# EAGLE design meroTV (EAGLE 6.6.0)
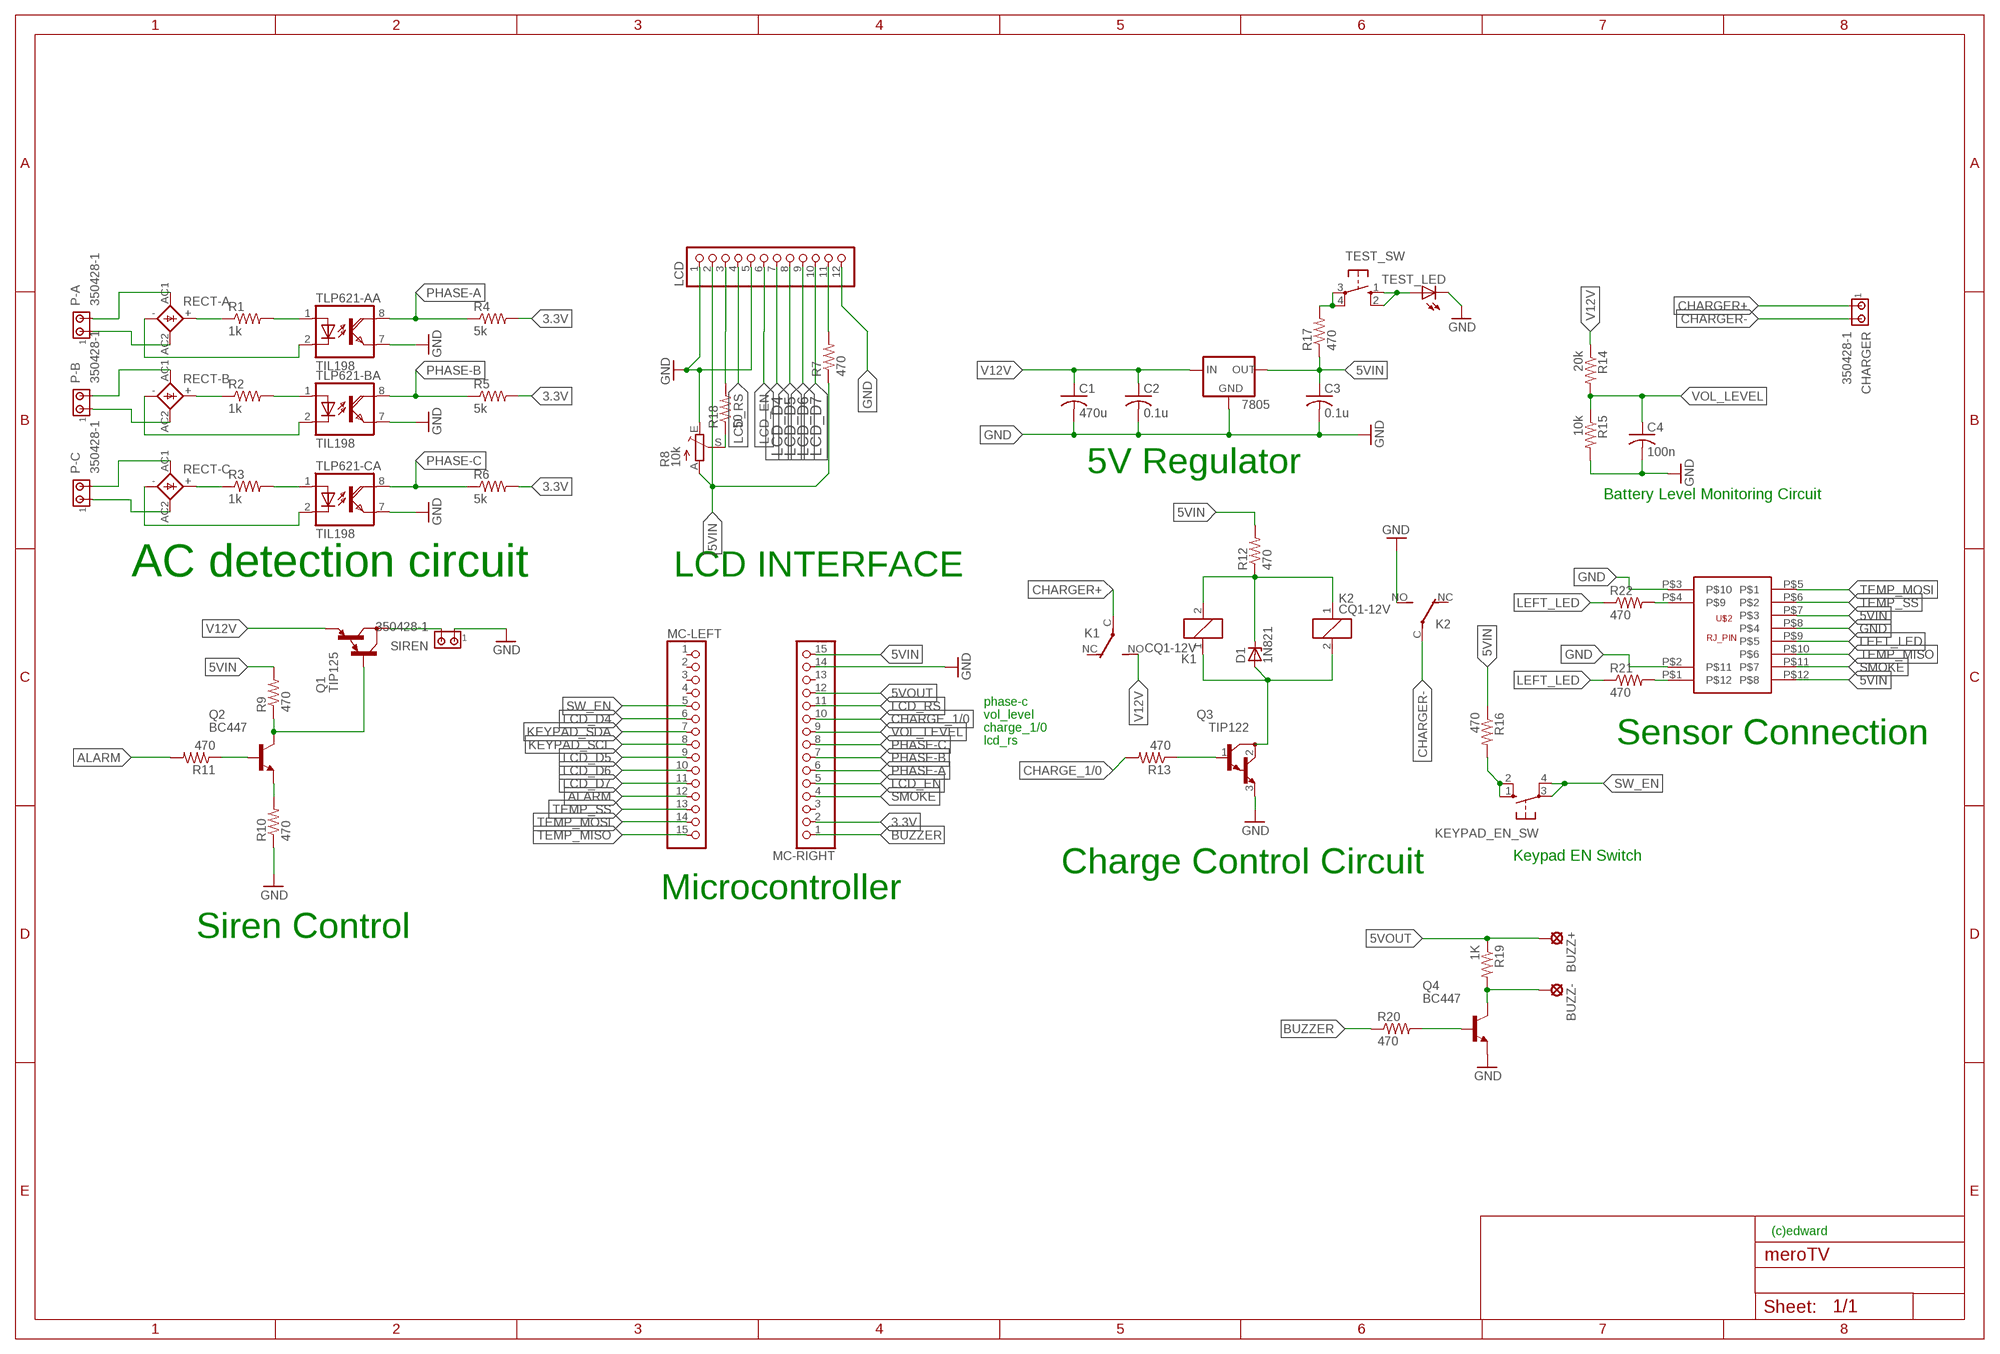
[diagram p0: schematic, sheet 1]

## Parts
7805  78MXXL  [78MXXL]
BUZZ+  SE11  [SE11]
BUZZ-  SE11  [SE11]
C1  470u  C-US025-040X050  [C025-040X050]
C2  0.1u  C-US025-030X050  [C025-030X050]
C3  0.1u  C-US025-030X050  [C025-030X050]
C4  100n  C-US025-030X050  [C025-030X050]
CHARGER  350428-1  [350428-1]
D1  1N821  [DO35Z10]
K1  CQ1-12V  [CQ1]
K2  CQ1-12V  [CQ1]
KEYPAD_EN_SW  10-XX  [B3F-10XX]
LCD  PINHD-1X12  [1X12]
MC-LEFT  PINHD-1X15  [1X15]
MC-RIGHT  PINHD-1X15  [1X15]
P-A  350428-1  [350428-1]
P-B  350428-1  [350428-1]
P-C  350428-1  [350428-1]
Q1  TIP125  [TO220]
Q2  BC447  [TO92-EBC]
Q3  TIP122  [TO220]
Q4  BC447  [TO92-EBC]
R1  1k  R-US_0204/5  [0204/5]
R2  1k  R-US_0204/5  [0204/5]
R3  1k  R-US_0204/5  [0204/5]
R4  5k  R-US_0204/5  [0204/5]
R5  5k  R-US_0204/5  [0204/5]
R6  5k  R-US_0204/5  [0204/5]
R7  470  R-US_0204/5  [0204/5]
R8  10k  TRIM_EU-B25V  [B25V]
R9  470  R-US_0204/5  [0204/5]
R10  470  R-US_0204/5  [0204/5]
R11  470  R-US_0204/5  [0204/5]
R12  470  R-US_0204/5  [0204/5]
R13  470  R-US_0204/5  [0204/5]
R14  20k  R-US_0204/5  [0204/5]
R15  10k  R-US_0204/5  [0204/5]
R16  470  R-US_0204/5  [0204/5]
R17  470  R-US_0204/5  [0204/5]
R18  50  R-US_0204/5  [0204/5]
R19  1K  R-US_0204/5  [0204/5]
R20  470  R-US_0204/5  [0204/5]
R21  470  R-US_0204/5  [0204/5]
R22  470  R-US_0204/5  [0204/5]
RECT-A  2KBB-R  [2KBB-R]
RECT-B  2KBB-R  [2KBB-R]
RECT-C  2KBB-R  [2KBB-R]
SIREN  350428-1  [350428-1]
TEST_LED  LED3MM  [LED3MM]
TEST_SW  10-XX  [B3F-10XX]
TLP621-A  TIL198  [DIL08]
TLP621-B  TIL198  [DIL08]
TLP621-C  TIL198  [DIL08]
U$2  RJ45_EDWRJ45-DIL  [RJ45-DIL]

## Nets
3.3V: MC-RIGHT.2 R4.2 R5.2 R6.2
5VIN: 7805.OUT C3.1 LCD.2 MC-RIGHT.15 R7.1 R8.A R9.2 R12.2 R16.1 R17.1 U$2.P$7 U$2.P$12
5VOUT: BUZZ+.MP MC-RIGHT.12 R19.1
ALARM: MC-LEFT.12 R11.2
BUZZER: MC-RIGHT.1 R20.1
CHARGE_1/0: MC-RIGHT.10 R13.2
CHARGER+: CHARGER.1 K1.C(2:P)
CHARGER-: CHARGER.2 K2.C(2:P)
GND: 7805.GND C1.2 C2.2 C3.2 C4.2 K2.NO(2:S) LCD.1 LCD.5 LCD.12 MC-RIGHT.14 Q3.3(E) Q4.E R8.E R10.1 R15.2 SIREN.1 TEST_LED.K(C) TLP621-A.7(A:EMI) TLP621-B.7(A:EMI) TLP621-C.7(A:EMI) U$2.P$2 U$2.P$3 U$2.P$8
KEYPAD_SCL: MC-LEFT.8
KEYPAD_SDA: MC-LEFT.7
LCD_D4: LCD.7 MC-LEFT.6
LCD_D5: LCD.8 MC-LEFT.9
LCD_D6: LCD.9 MC-LEFT.10
LCD_D7: LCD.10 MC-LEFT.11
LCD_EN: LCD.6 MC-RIGHT.5
LCD_RS: LCD.4 MC-RIGHT.11
LEFT_LED: R21.1 R22.1 U$2.P$9
N$1: Q1.2(C) SIREN.2
N$2: P-A.1 RECT-A.AC2
N$3: P-B.2 RECT-B.AC1
N$4: P-B.1 RECT-B.AC2
N$5: P-C.2 RECT-C.AC1
N$6: P-C.1 RECT-C.AC2
N$7: R1.1 RECT-A.+
N$8: R2.1 RECT-B.+
N$9: R1.2 TLP621-A.1(A:A)
N$10: R2.2 TLP621-B.1(A:A)
N$11: R3.2 TLP621-C.1(A:A)
N$12: R3.1 RECT-C.+
N$13: RECT-A.- TLP621-A.2(A:C)
N$14: RECT-B.- TLP621-B.2(A:C)
N$15: RECT-C.- TLP621-C.2(A:C)
N$16: D1.C K1.2 K2.1 R12.1
N$17: KEYPAD_EN_SW.1(S) KEYPAD_EN_SW.2(S1) R16.2
N$18: D1.A K1.1 K2.2 Q3.2(C)
N$19: Q1.1(B) Q2.C R9.1
N$20: Q2.E R10.2
N$21: Q2.B R11.1
N$22: Q3.1(B) R13.1
N$23: R17.2 TEST_SW.3(P) TEST_SW.4(P1)
N$24: TEST_LED.A TEST_SW.1(S) TEST_SW.2(S1)
N$25: LCD.11 R7.2
N$26: R8.S R18.1
N$27: LCD.3 R18.2
N$28: BUZZ-.MP Q4.C R19.2
N$29: R22.2 U$2.P$4
N$30: R21.2 U$2.P$1
N$31: Q4.B R20.2
P-A: P-A.2 RECT-A.AC1
PHASE-A: MC-RIGHT.6 R4.1 TLP621-A.8(A:COL)
PHASE-B: MC-RIGHT.7 R5.1 TLP621-B.8(A:COL)
PHASE-C: MC-RIGHT.8 R6.1 TLP621-C.8(A:COL)
SMOKE: MC-RIGHT.4 U$2.P$11
SW_EN: KEYPAD_EN_SW.3(P) KEYPAD_EN_SW.4(P1) MC-LEFT.5
TEMP_MISO: MC-LEFT.15 U$2.P$10
TEMP_MOSI: MC-LEFT.14 U$2.P$5
TEMP_SS: MC-LEFT.13 U$2.P$6
V12V: 7805.IN C1.1 C2.1 K1.NO(2:S) Q1.3(E) R14.1
VOL_LEVEL: C4.1 MC-RIGHT.9 R14.2 R15.1
Unconnected: K1.NC(2:O) K2.NC(2:O) MC-LEFT.1 MC-LEFT.2 MC-LEFT.3 MC-LEFT.4 MC-RIGHT.3 MC-RIGHT.13 TLP621-A.3(B:A) TLP621-A.4(B:C) TLP621-A.5(B:EMI) TLP621-A.6(B:COL) TLP621-B.3(B:A) TLP621-B.4(B:C) TLP621-B.5(B:EMI) TLP621-B.6(B:COL) TLP621-C.3(B:A) TLP621-C.4(B:C) TLP621-C.5(B:EMI) TLP621-C.6(B:COL)

## Notes on the sheet
- 5V Regulator
- Battery Level Monitoring Circuit
- AC detection circuit | LCD INTERFACE
- phase-c
- vol_level
- charge_1/0
- lcd_rs | Sensor Connection
- Keypad EN Switch
- Charge Control Circuit
- Microcontroller
- Siren Control
- (c)edward

## Library data of the parts
7805 = v-reg:78MXXL: VOLTAGE REGULATOR
BUZZ+ BUZZ- = solpad:SE11: SOLDER PAD RTM, drill 1,1mm, distributor Buerklin, 07F810
C1-C4 = rcl:C-US: CAPACITOR, American symbol
CHARGER P-A P-B P-C SIREN = con-amp:350428-1: Universal MATE-N-LOK .250" Centerline, 600 V, 19 - 36 A max Source: http://catalog.tycoelectronics.com/ .. ENG_CD_350428_Y.pdf
D1 = diode:1N821: Reference DIODE temperature compensated, 6,2 V
K1 K2 = relay:CQ1-12V: AUTOMOTIVE QUIET RELAY NAiS Source: http://www.mew-europe.com/.. en_ds_61208_0000.pdf; OC_FARNELL: unknown; OC_NEWARK: unknown
KEYPAD_EN_SW TEST_SW = switch-omron:10-XX: OMRON SWITCH; MPN: B3F-1000; OC_FARNELL: 176432; OC_NEWARK: 36M3542
LCD = pinhead:PINHD-1X12: PIN HEADER
MC-LEFT MC-RIGHT = pinhead:PINHD-1X15: PIN HEADER
Q1 = transistor-pnp:TIP125: PNP Transistor
Q2 Q4 = transistor-npn:BC447*: NPN Transistor
Q3 = transistor-npn:TIP122*: NPN Darlington Transistor
R1-R7 R9-R22 = rcl:R-US_: RESISTOR, American symbol
R8 = pot:TRIM_EU-: POTENTIOMETER
RECT-A RECT-B RECT-C = rectifier:2KBB-R: RECTIFIER grid 3 x 5 mm
TEST_LED = led:LED: LED OSRAM: - CHIPLED LG R971, LG N971, LY N971, LG Q971, LY Q971, LO R971, LY R971 LH N974, LH R974 LS Q976, LO Q976, LY Q976 LO Q996 - Hyper CHIPLED LW Q18S LB Q993, LB Q99A, LB R99A - SideLED LS A670, LO A670, LY A670, LG A670, LP A670 LB A673, LV A673, LT A673, LW A673 LH A674 LY A675 LS A676, LA A676, LO A676, LY A676, LW A676 LS A679, LY A679, LG A679 - Hyper Micro SIDELED® LS Y876, LA Y876, LO Y876, LY Y876 LT Y87S - SmartLED LW L88C, LW L88S LB L89C, LB L89S, LG L890 LS L89K, LO L89K, LY L89K LS L896, LA L896, LO L896, LY L896 - TOPLED LS T670, LO T670, LY T670, LG T670, LP T670 LSG T670, LSP T670, LSY T670, LOP T670, LYG T670 LG T671, LOG T671, LSG T671 LB T673, LV T673, LT T673, LW T673 LH T674 LS T676, LA T676, LO T676, LY T676, LB T676, LH T676, LSB T676, LW T676 LB T67C, LV T67C, LT T67C, LS T67K, LO T67K, LY T67K, LW E67C LS E67B, LA E67B, LO E67B, LY E67B, LB E67C, LV E67C, LT E67C LW T67C LS T679, LY T679, LG T679 LS T770, LO T770, LY T770, LG T770, LP T770 LB T773, LV T773, LT T773, LW T773 LH T774 LS E675, LA E675, LY E675, LS T675 LS T776, LA T776, LO T776, LY T776, LB T776 LHGB T686 LT T68C, LB T68C - Hyper Mini TOPLED® LB M676 - Mini TOPLED Santana® LG M470 LS M47K, LO M47K, LY M47K Source: http://www.osram.convergy.de LUXEON: - LUMILED® LXK2-PW12-R00, LXK2-PW12-S00, LXK2-PW14-U00, LXK2-PW14-V00 LXK2-PM12-R00, LXK2-PM12-S00, LXK2-PM14-U00 LXK2-PE12-Q00, LXK2-PE12-R00, LXK2-PE12-S00, LXK2-PE14-T00, LXK2-PE14-U00 LXK2-PB12-K00, LXK2-PB12-L00, LXK2-PB12-M00, LXK2-PB14-N00, LXK2-PB14-P00, LXK2-PB14-Q00 LXK2-PR12-L00, LXK2-PR12-M00, LXK2-PR14-Q00, LXK2-PR14-R00 LXK2-PD12-Q00, LXK2-PD12-R00, LXK2-PD12-S00 LXK2-PH12-R00, LXK2-PH12-S00 LXK2-PL12-P00, LXK2-PL12-Q00, LXK2-PL12-R00 Source: www.luxeon.com KINGBRIGHT: KA-3528ASYC Source: www.kingbright.com
TLP621-A TLP621-B TLP621-C = optocoupler:TIL198: TEXAS INSTRUMENTS OPTO COUPLER; OC_FARNELL: unknown; OC_NEWARK: unknown
U$2 = RJ45:RJ45_EDW

## Board
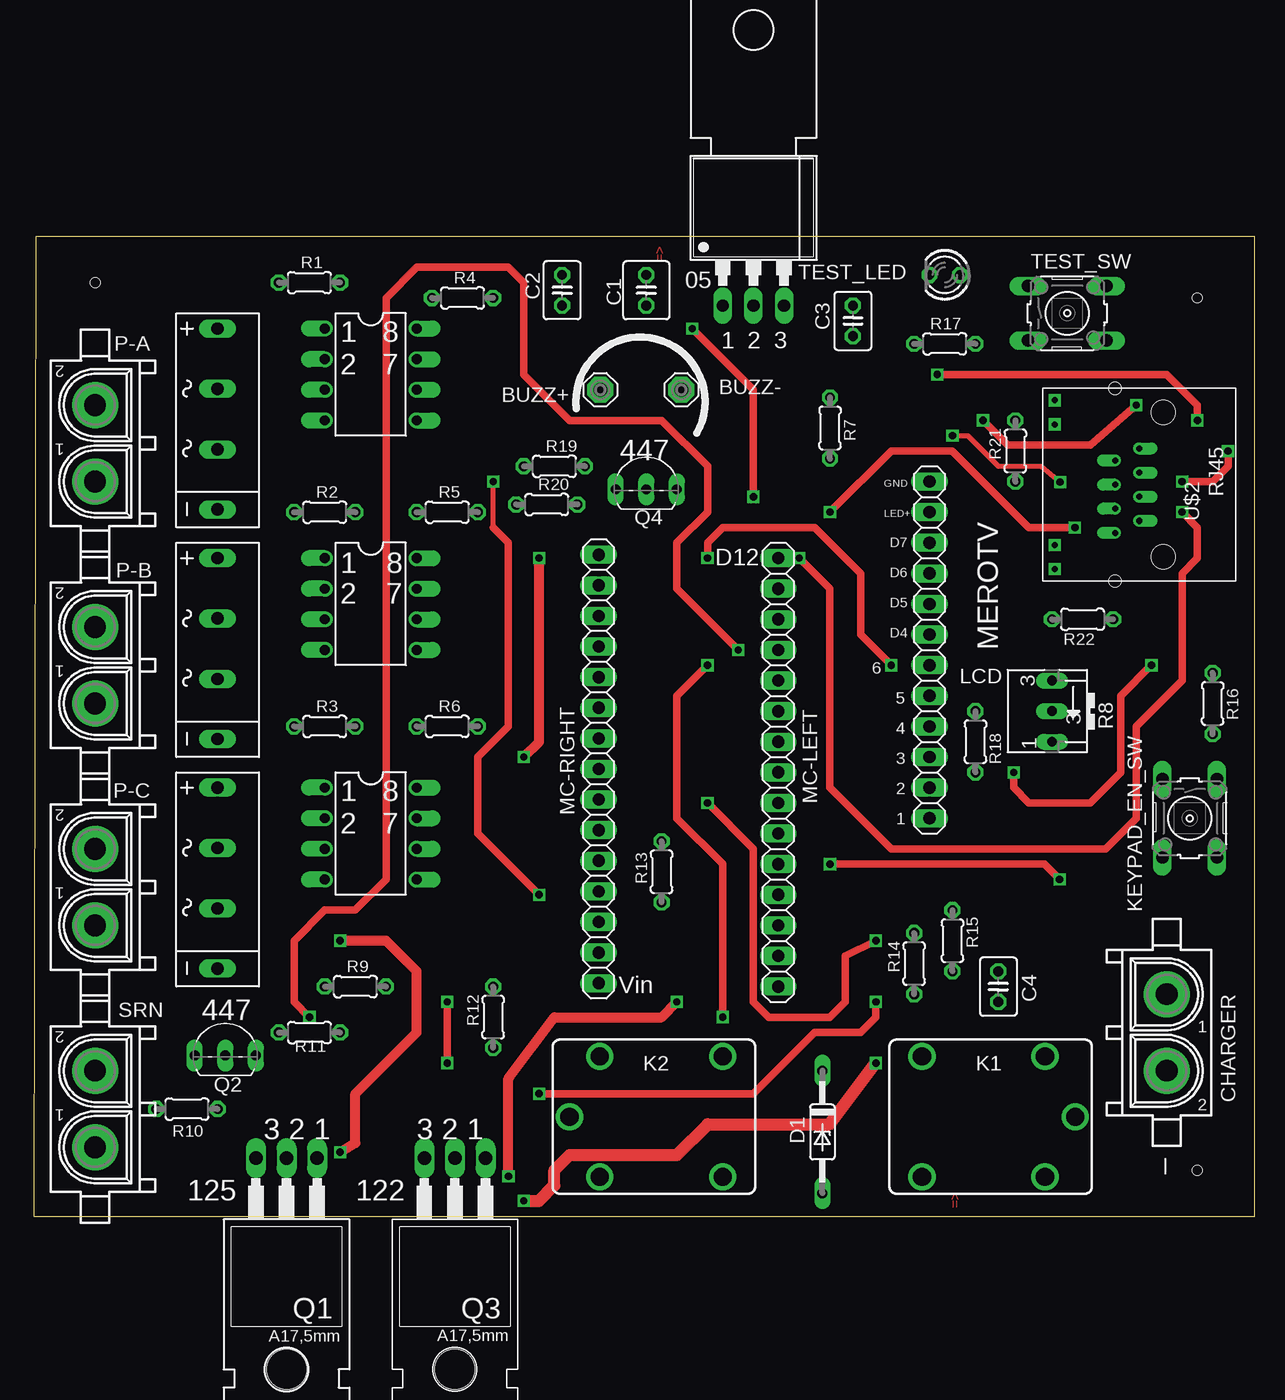
[diagram p1: board, top side]
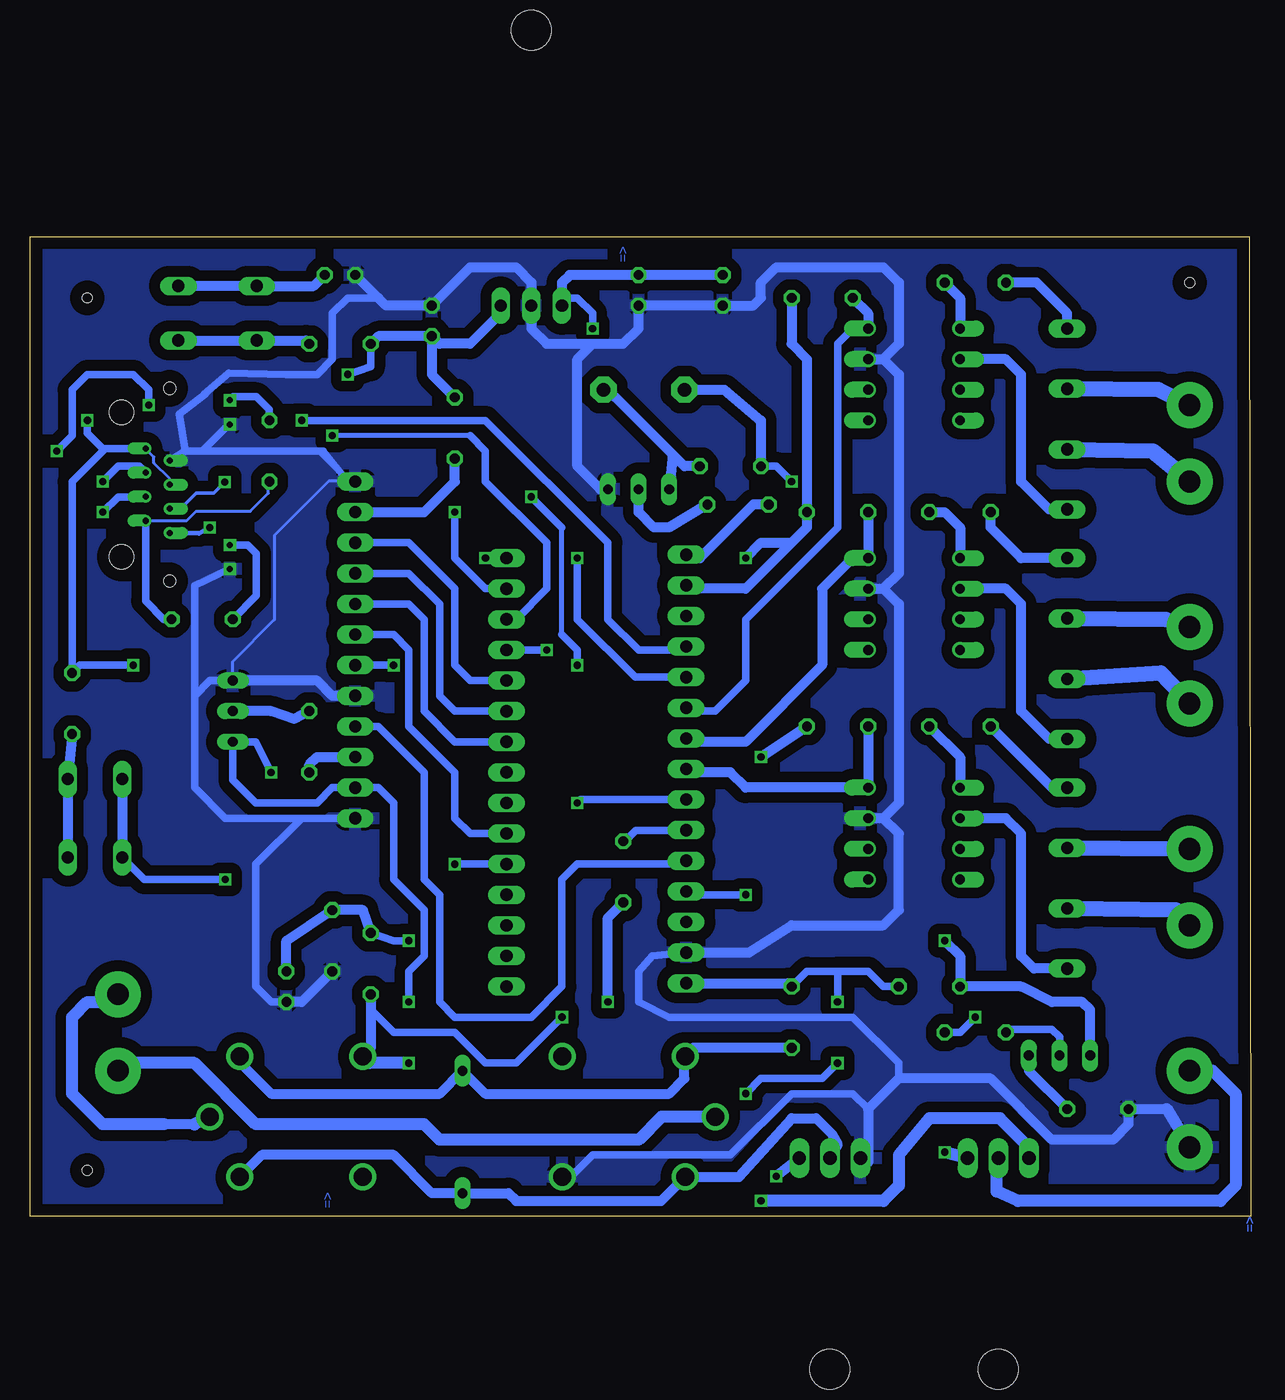
[diagram p2: board, bottom side, seen from below]

Size 101.27 x 81.27 mm. Coordinates in mm from the lower left corner, seen from the top.
Outline: 0,0 101.27,0 101.27,81.27 0.14,81.27 0,0
Copper layers (1*16): Top 0.035mm / dielectric 1.5mm / Bottom 0.035mm
Design rules "default *": minimum track width 10mil, minimum drill 24mil, track to track 35mil, track to pad 25mil, pad to pad 8mil, via to via 8mil, smd to smd 8mil, copper to edge 40mil, drill to drill 8mil, minimum pad ring 10mil, minimum via ring 8mil, stop-mask expansion 4mil, vias tented up to drill 0mil, thermal gap 10mil
Holes 0.8 mm at 96.52,3.81 96.52,76.2 5.08,77.47

### Footprints (pad centres in the part's own frame; a part is rotated, then mirrored left to right if it is on the bottom)
78MXXL = drill 1.016 long: GND 0,-5.08; IN -2.54,-5.08; OUT 2.54,-5.08 | hole 3.302: 0,17.78
SE11 = drill 1.118 pad 2.159 octagon: MP 0,0
C025-040X050 = drill 0.813 octagon: 1 -1.27,0; 2 1.27,0
C025-030X050 = drill 0.813 octagon: 1 -1.27,0; 2 1.27,0
350428-1 = drill 1.8 pad 3.81: 1 -3.175,0; 2 3.175,0
DO35Z10 = drill 0.813 long: A 5.08,0; C -5.08,0
CQ1 = drill 1.5: 1 4.5,-5; 2 4.5,5; C 7,0; NC -5.7,-5; NO -5.7,5
B3F-10XX = drill 1.016 long: 1 -3.251,2.261; 2 3.251,2.261; 3 -3.251,-2.261; 4 3.251,-2.261
1X12 = drill 1.016 long: 1 -13.97,0; 2 -11.43,0; 3 -8.89,0; 4 -6.35,0; 5 -3.81,0; 6 -1.27,0; 7 1.27,0; 8 3.81,0; 9 6.35,0; 10 8.89,0; 11 11.43,0; 12 13.97,0
1X15 = drill 1.016 long: 1 -17.78,0; 2 -15.24,0; 3 -12.7,0; 4 -10.16,0; 5 -7.62,0; 6 -5.08,0; 7 -2.54,0; 8 0,0; 9 2.54,0; 10 5.08,0; 11 7.62,0; 12 10.16,0; 13 12.7,0; 14 15.24,0; 15 17.78,0
TO220 = drill 1.118 long: 1 -2.54,-6.35; 2 0,-6.35; 3 2.54,-6.35 | hole 3.302: 0,11.176
TO92-EBC = drill 0.813 long: B 0,-1.27; C -2.54,-1.27; E 2.54,-1.27
0204/5 = drill 0.813 octagon: 1 -2.54,0; 2 2.54,0
B25V = drill 0.813 long: A 2.54,0.635; E -2.54,0.635; S 0,0.635
2KBB-R = drill 1.016 long: + -7.62,0; - 7.391,0; AC1 -2.616,0; AC2 2.413,0
LED3MM = drill 0.813 octagon: A -1.27,0; K 1.27,0
DIL08 = drill 0.813 offset: 1 -3.81,-3.81; 2 -1.27,-3.81; 3 1.27,-3.81; 4 3.81,-3.81; 5 3.81,3.81; 6 1.27,3.81; 7 -1.27,3.81; 8 -3.81,3.81
RJ45-DIL = drill 0.5 square: P$1 15,15; P$2 13,15; P$3 1,15; P$4 3,15 | drill 0.5 pad 1.016 offset: P$5 4,10; P$6 6,10; P$7 8,10; P$8 10,10; P$9 5,8; P$10 7,8; P$11 9,8; P$12 11,8 | hole 1: 16,10; 0,10 | hole 2: 14,6; 2,6

### Placement (x,y rotation side)
7805  59.69,80.64 0 top
BUZZ+  46.99,68.58 0 top
BUZZ-  53.7,68.58 0 top
C1  50.8,76.83 270 top
C2  43.81,76.83 270 top
C3  67.94,74.3 90 top
C4  80.01,19.05 270 top
CHARGER  93.98,15.24 270 top
D1  65.41,6.99 270 top
K1  79.38,8.26 0 top
K2  51.44,8.26 180 top
KEYPAD_EN_SW  95.89,33.02 270 top
LCD  74.3,46.99 90 top
MC-LEFT  61.75,36.83 90 top
MC-RIGHT  46.85,37.11 270 top
P-A  5.08,64.14 90 top
P-B  5.08,45.72 90 top
P-C  5.08,27.3 90 top
Q1  20.95,-1.54 180 top
Q2  15.88,14.61 0 top
Q3  34.92,-1.54 180 top
Q4  50.8,61.59 0 top
R1  22.86,77.47 0 top
R2  24.13,58.42 0 top
R3  24.13,40.64 0 top
R4  35.56,76.2 0 top
R5  34.29,58.42 0 top
R6  34.29,40.64 0 top
R7  66.04,65.41 270 top
R8  83.82,41.91 270 top
R9  26.67,19.05 0 top
R10  12.7,8.89 0 top
R11  22.86,15.24 0 top
R12  38.1,16.51 90 top
R13  52.07,28.57 90 top
R14  73.03,20.95 90 top
R15  76.2,22.86 270 top
R16  97.79,42.55 270 top
R17  75.56,72.39 0 top
R18  78.11,39.37 270 top
R19  43.18,62.23 0 top
R20  42.55,59.05 0 top
R21  81.42,63.5 90 top
R22  87,49.53 180 top
RECT-A  15.24,66.04 270 top
RECT-B  15.24,46.99 270 top
RECT-C  15.24,27.94 270 top
SIREN  5.08,8.89 90 top
TEST_LED  75.56,78.11 180 top
TEST_SW  85.72,74.93 0 top
TLP621-A  27.94,69.85 270 top
TLP621-B  27.94,50.8 270 top
TLP621-C  27.94,31.75 270 top
U$2  99.69,52.7 90 top

### Tracks (layer width: path | path; a pad name or v marks a point on that pad's centre or on a via)
3.3V  (via drill 0.6)
  Top 0.813: v40.64,38.1 41.91,39.37 v41.91,54.61
  Bottom 0.813: 38.1,55.88 36.83,57.15 R5.2 36.83,71.12 38.1,72.39 R4.2 | 38.1,55.88 41.91,52.07 46.57,52.07 MC-RIGHT.2 | R6.2 v40.64,38.1 | v41.91,54.61 40.64,55.88 38.1,55.88
5VIN  (via drill 0.6)
  Top 0.61: v81.28,36.83 81.28,35.56 82.55,34.29 87.63,34.29 90.17,36.83 90.17,43.18 v92.71,45.72 | v74.93,69.85 93.98,69.85 96.52,67.31 v96.52,66.04 | v69.85,17.78 69.85,16.51 68.58,15.24 64.77,15.24 59.69,10.16 v41.91,10.16 | v34.29,12.7 v34.29,17.78
  Bottom 0.254: U$2.P$7 89.69,61.2 91,62.5 91,63.01 U$2.P$12
  Bottom 0.61: U$2.P$12 95.05,63.7 | 95.05,63.7 95.25,63.7 96.52,64.97 v96.52,66.04 | 95.05,63.7 97.79,60.96 R16.1 97.16,45.72 v92.71,45.72 | v81.28,36.83 82.55,39.37 R8.A 84.45,36.2 82.55,34.29 77.47,34.29 76.2,35.56 LCD.2 72.39,35.56 71.12,34.29 71.12,27.94 68.58,25.4 68.58,21.59 69.85,20.32 v69.85,17.78 | R17.1 73.03,70.48 v74.93,69.85 | v41.91,10.16 40.64,11.43 35.56,11.43 v34.29,12.7 | v34.29,17.78 34.29,20.32 | R9.2 30.48,19.05 31.75,20.32 34.29,20.32 | R12.2 36.83,20.32 34.29,20.32
  Bottom 0.813: 7805.OUT 62.23,74.93 64.77,72.39 67.31,72.39 C3.1 | C3.1 72.39,73.03 R17.1 | C3.1 67.94,69.85 R7.1 | MC-RIGHT.15 38.38,19.33 R12.2
5VOUT  (via drill 0.6)
  Top 0.406: 38.1,57.15 v38.1,60.96
  Top 0.61: v41.91,26.67 36.83,31.75 36.83,38.1 39.37,40.64 39.37,55.88 38.1,57.15
  Bottom 0.61: R19.1 39.37,62.23 v38.1,60.96 | v41.91,26.67 46.57,26.67 MC-RIGHT.12
  Bottom 0.813: BUZZ+.MP 43.68,68.58 40.64,66.04 R19.1
ALARM  (via drill 0.6)
  Top 0.61: v22.86,16.51 21.59,17.78 21.59,22.86 24.13,25.4 26.67,25.4 29.21,27.94 29.21,76.2 31.75,78.74 39.37,78.74 40.64,77.47 40.64,69.85 44.45,66.04 52.07,66.04 55.88,62.23 55.88,58.42 53.34,55.88 53.34,52.07 v58.42,46.99
  Bottom 0.61: R11.2 24.13,15.24 v22.86,16.51 | v58.42,46.99 MC-LEFT.12
BUZZER
  Bottom 0.813: R20.1 41.27,59.05 45.72,54.61 46.57,54.61 MC-RIGHT.1
CHARGE_1/0
  Bottom 0.61: R13.2 51.94,31.11 51.03,32.02 48.34,32.02 MC-RIGHT.10
CHARGER+
  Bottom 0.813: 87.64,7.61 90.17,7.62
  Bottom 1.016: K1.C 87.64,7.61 | 90.17,7.62 95.25,7.62 97.79,10.16 97.79,16.51 96.52,17.78 94.61,17.78 CHARGER.1
CHARGER-
  Bottom 1.016: K2.C 48.9,8.26 50.8,6.35 67.31,6.35 68.58,7.62 82.55,7.62 87.63,12.7 93.34,12.7 CHARGER.2
GND
  Bottom 0.254: 87,63.5 77.5,63.5 75,61 76.5,61 81,56.5 81,49.5 84.5,46 84.5,44.49 R8.E
  Bottom 0.61: 29.21,11.43 29.21,12.7 33.02,16.51 48.26,16.51 50.8,17.78 50.8,20.32 49.67,21.59 MC-RIGHT.14 | K2.NO 56.44,3.25 54.61,5.08 43.18,5.08 38.1,10.16 33.02,10.16 31.75,8.89 | C4.2 81.28,17.78 82.55,19.05 82.55,29.21 78.74,33.02 LCD.1 85.09,33.02 87.63,35.56 87.63,43.18 | 87.63,43.18 86.36,44.45 R8.E | 84.77,53.7 87.63,52.34 87.63,43.18 | 86.73,68.2 88.9,66.54 88.4,63.5 | 72.39,76.2 74.93,76.2 76.2,74.93 76.2,71.12 77.47,69.85 80.01,69.85 84.81,69.95 86.81,68.2 | LCD.12 74.93,60.96 76.97,63.5 87,63.5 | 87,63.5 88.4,63.5 | 88.4,63.5 U$2.P$8 | U$2.P$2 84.8,65.7 87,63.5
  Bottom 0.813: TLP621-A.7 30.48,71.12 | 30.48,71.12 29.21,69.85 29.21,53.34 30.48,52.07 | TLP621-B.7 30.48,52.07 | 30.48,52.07 29.21,50.8 29.21,34.29 30.48,33.02 | 30.48,33.02 TLP621-C.7 | TEST_LED.K 72.39,76.2 71.75,75.56 C3.2 64.77,78.74 60.96,78.74 59.69,77.47 7805.GND 59.69,73.66 58.42,72.39 54.61,72.39 | R15.2 78.74,17.78 C4.2 | LCD.5 76.2,43.18 77.47,44.45 R8.E | 6.99,8.89 R10.1 10.16,7.62 11.43,6.35 16.51,6.35 21.59,11.43 29.21,11.43 31.75,8.89 31.75,4.45 Q3.3 | 30.48,71.12 29.21,72.39 29.21,77.47 30.48,78.74 39.37,78.74 40.64,77.47 40.64,76.2 41.27,75.56 C2.2 C1.2 50.8,73.66 52.07,72.39 54.61,72.39 | Q4.E 53.98,60.33 55.88,62.23 55.88,71.12 54.61,72.39 | MC-RIGHT.14 41.63,21.87 38.1,24.13 30.48,24.13 29.21,25.4 29.21,31.75 30.48,33.02
  Bottom 1.016: 6.99,8.89 SIREN.1
  pour Bottom: 0,80.78 1.27,0 101.6,-1.27 101.5,62.5 102,81.78
LCD_D4
  Bottom 0.61: LCD.7 71.12,48.26 69.85,46.99 69.85,40.64 66.04,36.83 66.04,33.02 64.77,31.75 MC-LEFT.6
LCD_D5
  Bottom 0.61: MC-LEFT.9 66.04,39.37 68.58,41.91 68.58,49.53 69.85,50.8 LCD.8
LCD_D6
  Bottom 0.61: MC-LEFT.10 66.04,41.91 67.31,43.18 67.31,50.8 69.85,53.34 LCD.9
LCD_D7
  Bottom 0.61: MC-LEFT.11 64.77,44.45 66.04,45.72 66.04,52.07 69.85,55.88 LCD.10
LCD_EN  (via drill 0.6)
  Top 0.61: v71.12,45.72 68.58,48.26 68.58,53.34 64.77,57.15 57.15,57.15 55.88,55.88 v55.88,54.61
  Bottom 0.61: MC-RIGHT.5 51.08,44.73 55.88,49.53 v55.88,54.61 | v71.12,45.72 LCD.6
LCD_RS
  Bottom 0.61: MC-RIGHT.11 47.13,29.21 55.88,29.21 57.15,27.94 57.15,19.05 59.69,16.51 66.04,16.51 67.31,17.78 67.31,26.67 68.58,27.94 68.58,36.83 72.39,40.64 LCD.4
LEFT_LED
  Bottom 0.254: U$2.P$9 88.3,57.7 87.5,58.5 83,58.5 81.5,60 81.5,60.88 R21.1
  Bottom 0.61: 89.69,49.69 R22.1 90.17,49.53 91.69,51.05 U$2.P$9
N$1
  Bottom 1.016: SIREN.2 3.17,12.06 1.27,10.16 1.27,2.54 2.54,1.27 19.32,1.27 21.09,2.04 21.09,3.17 Q1.2
N$2
  Bottom 1.27: P-A.1 8.13,63.5 RECT-A.AC2
N$3
  Bottom 1.27: P-B.2 7.06,49.53 RECT-B.AC1
N$4
  Bottom 1.27: P-B.1 7.49,45.09 RECT-B.AC2
N$5
  Bottom 1.27: P-C.2 6.43,30.48 RECT-C.AC1
N$6
  Bottom 1.27: P-C.1 6.22,25.4 RECT-C.AC2
N$7
  Bottom 0.813: RECT-A.+ 15.24,74.93 17.78,77.47 R1.1
N$8
  Bottom 0.813: RECT-B.+ 19.05,54.61 21.59,57.15 R2.1
N$9
  Bottom 0.813: R1.2 24.13,76.2 TLP621-A.1
N$10
  Bottom 0.813: R2.2 25.4,58.42 24.13,57.15 TLP621-B.1
N$11
  Bottom 0.813: R3.2 24.13,38.1 TLP621-C.1
N$12
  Bottom 0.813: RECT-C.+ 16.51,35.56 R3.1
N$13
  Bottom 0.813: RECT-A.- 16.74,58.65 19.05,60.96 19.05,69.85 20.32,71.12 TLP621-A.2
N$14
  Bottom 0.813: RECT-B.- 16.74,39.6 19.05,41.91 19.05,50.8 20.32,52.07 TLP621-B.2
N$15
  Bottom 0.813: RECT-C.- 18.01,20.55 19.05,21.59 19.05,31.75 20.32,33.02 TLP621-C.2
N$16
  Bottom 0.813: R12.1 46.22,13.97 K2.1 46.99,13.2 46.99,11.43 48.26,10.16 63.5,10.16 D1.C 67.31,10.16 81.28,10.16 83.88,12.76 K1.2
N$17
  Bottom 0.813: R16.2 KEYPAD_EN_SW.1 KEYPAD_EN_SW.2
N$18
  Bottom 0.813: K1.1 82.05,5.08 71.12,5.08 67.94,1.91 D1.A 61.59,1.91 60.96,1.27 48.92,1.27 K2.2 42.47,3.25 38.1,8.12 36.06,8.12 34.79,6.85 34.29,5.95 Q3.2
N$19  (via drill 0.6)
  Top 0.813: v25.4,5.31 26.67,6.08 26.67,10.16 31.75,15.24 31.75,20.32 29.21,22.86 v25.4,22.86
  Bottom 0.813: Q2.C 13.34,17.14 13.97,17.78 16.51,17.78 19.05,19.05 R9.1 24.13,21.59 v25.4,22.86
  Bottom 1.016: Q1.1 v25.4,5.31
N$20
  Bottom 0.813: Q2.E 18.41,12.06 R10.2
N$21
  Bottom 0.61: Q2.B 15.88,14.88 16.5,15.5 20.06,15.5 R11.1
N$22  (via drill 0.6)
  Top 0.813: v39.37,3.31 39.37,11.43 43.18,16.51 52.07,16.51 v53.34,17.78
  Bottom 0.813: Q3.1 v39.37,3.31 | v53.34,17.78 53.34,24.77 R13.1
N$23
  Bottom 0.813: TEST_SW.4 TEST_SW.3 78.38,72.67 R17.2
N$24
  Bottom 0.813: TEST_LED.A 77.75,77.19 TEST_SW.1 TEST_SW.2
N$25
  Bottom 0.813: LCD.11 68.58,58.42 66.04,60.96 R7.2
N$26
  Bottom 0.813: R18.1 79.38,41.27 81.28,41.91 R8.S
N$27
  Bottom 0.813: R18.2 78.11,37.47 77.47,38.1 LCD.3
N$28
  Bottom 0.813: 47.94,63.18 Q4.C | BUZZ-.MP 52.7,67.94 47.94,63.18 | R19.2 46.99,62.23 47.94,63.18
N$29
  Bottom 0.61: U$2.P$4 83.2,55.7 82.5,55 82.5,51.48 R22.2
N$30
  Bottom 0.61: R21.2 81.42,66.92 82.5,68 84.4,68 U$2.P$1
N$31
  Bottom 0.813: R20.2 48.26,57.15 49.53,57.15 50.8,58.42 Q4.B
P-A
  Bottom 1.27: P-A.2 7.7,68.58 RECT-A.AC1
PHASE-A
  Bottom 0.406: TLP621-A.8 33.02,73.66 | 46.57,41.91 MC-RIGHT.6
  Bottom 0.61: 33.02,73.66 34.29,72.39 34.29,57.15 41.91,49.53 41.91,44.45 44.45,41.91 46.57,41.91
  Bottom 0.813: R4.1 31.75,74.93 TLP621-A.8
PHASE-B
  Bottom 0.813: R5.1 TLP621-B.8 33.02,54.61 35.56,52.07 35.56,45.72 41.91,39.37 46.57,39.37 MC-RIGHT.7
PHASE-C
  Bottom 0.813: R6.1 TLP621-C.8 41.91,35.56 43.18,36.83 46.57,36.83 MC-RIGHT.8
SMOKE  (via drill 0.6)
  Top 0.61: v78.74,66.04 80.78,64 87.63,64 v91.44,67.31 | v99.06,63.5 99.06,62.23 97.79,60.96 v95.25,60.96
  Bottom 0.61: MC-RIGHT.4 47.13,46.99 50.8,46.99 53.34,49.53 53.34,55.88 63.5,66.04 v78.74,66.04 | v91.44,67.31 91.44,68.58 92.71,69.85 96.52,69.85 97.79,68.58 97.79,64.77 v99.06,63.5 | v95.25,60.96 93.98,62.23 92.22,62.23 U$2.P$11
SW_EN  (via drill 0.6)
  Top 0.61: v85.09,27.94 83.82,29.21 v66.04,29.21
  Bottom 0.61: KEYPAD_EN_SW.4 91.8,27.94 v85.09,27.94 | v66.04,29.21 MC-LEFT.5
  Bottom 0.813: KEYPAD_EN_SW.3 KEYPAD_EN_SW.4
TEMP_MISO  (via drill 0.6)
  Top 0.61: v63.5,54.61 66.04,52.07 66.04,35.56 71.12,30.48 88.9,30.48 91.44,33.02 91.44,40.64 95.25,44.45 95.25,53.34 96.52,54.61 96.52,57.15 v95.25,58.42
  Bottom 0.61: MC-LEFT.15 v63.5,54.61 | U$2.P$10 91.71,59.69 93.98,59.69 v95.25,58.42
TEMP_MOSI  (via drill 0.6)
  Top 0.61: v66.04,58.42 71.12,63.5 76.2,63.5 82.55,57.15 v86.36,57.15
  Bottom 0.406: v86.36,57.15 87.25,56.65 U$2.P$5
  Bottom 0.61: MC-LEFT.14 63.5,52.07 66.04,54.61 v66.04,58.42
TEMP_SS  (via drill 0.6)
  Top 0.406: v76.2,64.77 77.47,64.77 80.01,62.23 83.55,62.23 v85.13,60.92
  Bottom 0.305: U$2.P$6 88.8,58.7 87.5,60 86.05,60 v85.13,60.92
  Bottom 0.406: 64.77,64.77 v76.2,64.77
  Bottom 0.61: MC-LEFT.13 60.96,49.53 58.42,52.07 58.42,55.88 63.5,60.96 63.5,63.5 64.77,64.77
V12V  (via drill 0.6)
  Top 0.61: v57.15,16.51 57.15,29.21 53.34,33.02 53.34,43.18 v55.88,45.72 | v59.69,59.69 59.69,68.58 v54.61,73.66
  Top 1.016: v40.64,1.27 41.91,1.27 43.18,2.54 43.18,3.81 44.45,5.08 53.34,5.08 55.88,7.62 66.04,7.62 v69.85,12.7
  Bottom 0.406: 57.15,48.26 57.15,57.15
  Bottom 0.61: 73.12,12.7 K1.NO | R14.1 73.03,17.14 71.12,15.24 66.04,15.24 63.5,12.7 60.96,12.7 v57.15,16.51 | v55.88,45.72 55.88,46.99 57.15,48.26 | 57.15,57.15 v59.69,59.69 | v54.61,73.66 54.61,74.93 55.88,76.2 56.52,76.2 7805.IN
  Bottom 0.813: C2.1 C1.1 56.52,78.11 57.15,77.47 7805.IN | R14.1 73.03,13.9 K1.NO
  Bottom 1.016: Q1.3 18.41,5.71 20.82,8.12 26.67,8.12 29.21,5.08 29.21,2.54 30.48,1.27 v40.64,1.27 | v69.85,12.7 73.12,12.7
VOL_LEVEL  (via drill 0.6)
  Top 0.61: v55.88,34.29 59.69,30.48 59.69,17.78 60.96,16.51 66.04,16.51 67.31,17.78 67.31,21.59 v69.85,22.86
  Bottom 0.61: MC-RIGHT.9 55.6,34.57 v55.88,34.29 | v69.85,22.86 71.12,22.86 R14.2
  Bottom 0.813: R14.2 73.66,25.4 R15.1 80.01,22.86 C4.1

### Text on the board
Top: => | =>
Bottom: => | => | => | =>
tPlace: 05 | 1 2 3 | 1 8 / 2 7 | 447 | GND | LED+ | D7 | D12 | 1 | 8 | D6 | 2 | 7 | D5 | D4 | MEROTV | 6 | 5 | 4 | 3 | 2 | 1 8 / 2 7 | 1 | Vin | SRN | 447 | 3 2 1 | 3 2 1 | _ | 125 | 122